# Altium project rovables_expansion.PrjPcb
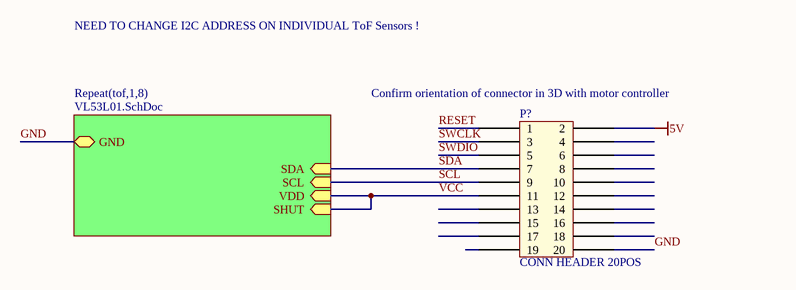
[diagram p0: expansion.SchDoc]
2 sheets, 41 parts. Net scope: hierarchical (ports join the sheet entries above them; power ports are global).
Board file: expansion.PcbDoc
Sheets:
  expansion.SchDoc
    tof1 = VL53L01.SchDoc
    tof2 = VL53L01.SchDoc
    tof3 = VL53L01.SchDoc
    tof4 = VL53L01.SchDoc
    tof5 = VL53L01.SchDoc
    tof6 = VL53L01.SchDoc
    tof7 = VL53L01.SchDoc
    tof8 = VL53L01.SchDoc

## Sheet expansion.SchDoc
size A; SheetNumber: 1; SheetTotal: 2

### Parts
P?  CONN HEADER 20POS  [DF12 20 POS]

### Sub-sheets
Repeat(tof,1,8) = VL53L01.SchDoc: GND (bidir), SCL (in), SDA (in), VDD (in), SHUT (in)

### Nets
5V: P?.2
GND: P?.20 ; sheet Repeat(tof,1,8)/GND
RESET: P?.1
SCL: P?.9 ; sheet Repeat(tof,1,8)/SCL
SDA: P?.7 ; sheet Repeat(tof,1,8)/SDA
SWCLK: P?.3
SWDIO: P?.5
VCC: P?.11 ; sheet Repeat(tof,1,8)/VDD, sheet Repeat(tof,1,8)/SHUT

Not connected (* = marked no-connect by the designer): P? 4 6 8 10 12 13 14 15 16 17 18 19

### Notes on the sheet
- NEED TO CHANGE I2C ADDRESS ON INDIVIDUAL ToF Sensors !
- (near P?) Confirm orientation of connector in 3D with motor controller

### Library data of the parts
P? = CONN HEADER 20POS: manufacturer part number: DF12D(4.0)-20DP-0.5V(81); manufacturer: Hirose Electric Co Ltd; digikey part number: H11743CT-ND; Supplier 1: Digi-Key; Supplier Part Number 1: H11743CT-ND

## Sheet VL53L01.SchDoc
size A; SheetNumber: 2; SheetTotal: 2
Used 8 times, as channels tof1, tof2, tof3, tof4, tof5, tof6, tof7, tof8. Parts and nets are listed once, with the designators drawn on the sheet.
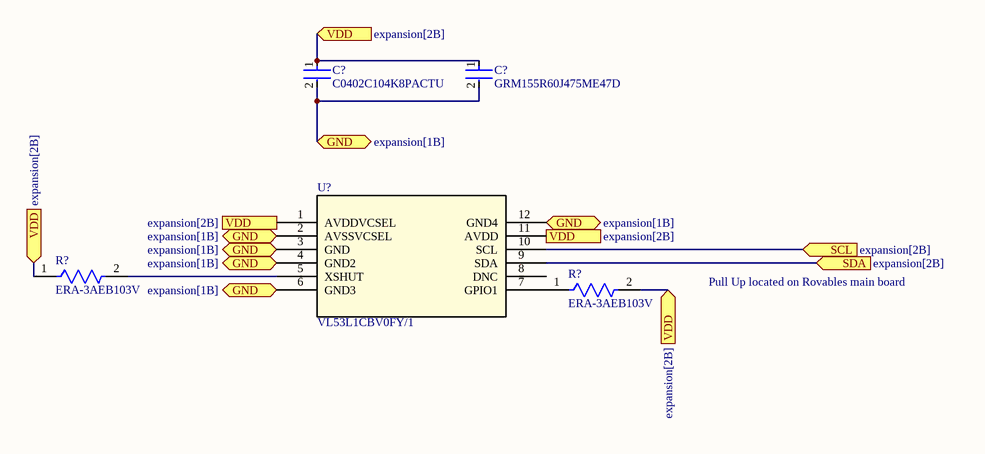
[diagram p1: VL53L01.SchDoc]

### Parts
(Parts that share a designator on the sheet are numbered #1, #2 ... from top to bottom, then left to right.)
C?#1  C0402C104K8PACTU  [FP-C0402-BB-MFG]
C?#2  GRM155R60J475ME47D  [FP-GRM155-0_1-IPC_B]
R?#1  ERA-3AEB103V  [FP-ERA3A-IPC_C]
R?#2  ERA-3AEB103V  [FP-ERA3A-IPC_C]
U?  VL53L1CBV0FY/1  [QFN_BV0FY/1_STM-M]

### Ports
GND (bidir, see expansion[1B]), SCL (in, see expansion[2B]), SDA (in, see expansion[2B]), VDD (in, see expansion[2B])

### Nets
GND: C?#1.2 C?#2.2 U?.2(AVSSVCSEL) U?.3(GND) U?.4(GND2) U?.6(GND3) U?.12(GND4) ; port GND
SCL: U?.10(SCL) ; port SCL
SDA: U?.9(SDA) ; port SDA
VDD: C?#1.1 C?#2.1 R?#1.1 R?#2.2 U?.1(AVDDVCSEL) U?.11(AVDD) ; port VDD
NetR?#1_2: R?#1.2 U?.5(XSHUT)
NetR?#2_1: R?#2.1 U?.7(GPIO1)

Not connected (* = marked no-connect by the designer): U? 8(DNC)

### Channels
tof1: designators C?=C?_tof1#1 C?=C?_tof1#2 R?=R?_tof1#1 R?=R?_tof1#2 U?=U?_tof1; ports GND=GND SCL=SCL SDA=SDA VDD=VCC
tof2: designators C?=C?_tof2#1 C?=C?_tof2#2 R?=R?_tof2#1 R?=R?_tof2#2 U?=U?_tof2; ports GND=GND SCL=SCL SDA=SDA VDD=VCC
tof3: designators C?=C?_tof3#1 C?=C?_tof3#2 R?=R?_tof3#1 R?=R?_tof3#2 U?=U?_tof3; ports GND=GND SCL=SCL SDA=SDA VDD=VCC
tof4: designators C?=C?_tof4#1 C?=C?_tof4#2 R?=R?_tof4#1 R?=R?_tof4#2 U?=U?_tof4; ports GND=GND SCL=SCL SDA=SDA VDD=VCC
tof5: designators C?=C?_tof5#1 C?=C?_tof5#2 R?=R?_tof5#1 R?=R?_tof5#2 U?=U?_tof5; ports GND=GND SCL=SCL SDA=SDA VDD=VCC
tof6: designators C?=C?_tof6#1 C?=C?_tof6#2 R?=R?_tof6#1 R?=R?_tof6#2 U?=U?_tof6; ports GND=GND SCL=SCL SDA=SDA VDD=VCC
tof7: designators C?=C?_tof7#1 C?=C?_tof7#2 R?=R?_tof7#1 R?=R?_tof7#2 U?=U?_tof7; ports GND=GND SCL=SCL SDA=SDA VDD=VCC
tof8: designators C?=C?_tof8#1 C?=C?_tof8#2 R?=R?_tof8#1 R?=R?_tof8#2 U?=U?_tof8; ports GND=GND SCL=SCL SDA=SDA VDD=VCC

### Notes on the sheet
- Pull Up located on Rovables main board

### Library data of the parts
C?#1 = CMP-2008-02046-2: CAP CER 0.1UF 10V X5R 0402; Manufacturer: Kemet; Material: Ceramic; Capacitance: 0.10 μF; Temperature Coefficient: 15%; Tolerance: 0.1; Value: 0.10 μF; Package: C0402-BB; Temperature: -55°C to +125°C; ComponentLink2Description: Datasheet; Temperature Characteristic: X5R; Device Class L1: Passive Components; Height: 0.55mm; Lead Free: Yes; ComponentLink2URL: https://content.kemet.com/datasheets/KEM_C1002_X7R_SMD.pdf; Device Class L2: Capacitors; Temperature Range Low: -55°C; Temperature Range High: +125°C; RoHS: TRUE; Octopart: https://octopart.com/c0402c104k8pactu-kemet-140039; Automotive: No; Mouser Description: Capacitor 100 nF 10 VDC 0402; Category: Cap; Voltage Rating: 10 V; Digikey Description: CAP CER 0.1UF 10V X5R 0402; Ipc Land Pattern Name: CAPC10050X50; Device Class L3: Ceramic Capacitors; Manufacturer Part Number: C0402C104K8PACTU
C?#2 = CMP-2008-04549-2: Chip Multilayer Ceramic Capacitors for General Purpose, 0402, 4.7uF, X5R, 15%, 20%, 6.3V; Height: 0.5mm; Weight: 0.000212oz; Length: 1mm; Case Code (Metric): 1005; Packaging: Tape and Reel; Termination: SMD/SMT; Dielectric: X5R; Depth: 0.5mm; Case Code (Imperial): 0402; Min Operating Temperature: -55°C; Case/Package: 0402; Voltage: 6.3V; Width: 0.02inch; Capacitance: 4.7uF; Lead Free: Lead Free; Thickness: 0.022inch; Contact Plating: Tin; REACH SVHC: No SVHC; Package Quantity: 10000; Tolerance: 20%; Voltage Rating (DC): 6.3V; Voltage Rating: 6.3V; Mount: Surface Mount; Max Operating Temperature: 85°C
R?#1 R?#2 = CMP-2000-00874-2: RES SMD 10K OHM 0.1% 1/10W 0603; Voltage Rating (DC): 75V; Power Rating: 100mW; Resistance: 10kR; Temperature Coefficient: 25ppm/°C; Radiation Hardening: No; Width: 0.8mm; Depth: 0.8mm; Construction: Rectangular; Case Code (Metric): 1608; Package Quantity: 5000; Length: 1.6mm; Size Code: 0603; Case Code (Imperial): 0603; Termination: SMD/SMT; Contact Plating: Tin; Resistance Tolerance: 0.1%; Military Standard: Not; Packaging: Tape and Reel; Max Power Dissipation: 100mW; REACH SVHC: No SVHC; Series: ERA-3A; Voltage Rating: 75V; Lead Free: Lead Free; Technology: METAL FILM; RoHS Compliant: Yes; Max Operating Temperature: 155°C; Resistor Type: Thin Film; Min Operating Temperature: -55°C; Number of Pins: 2; Case/Package: 0603; Tolerance: 0.1%; Height: 0.45mm; Mount: Surface Mount; Number of Terminations: 2
U? = VL53L1CBV0FY/1: No Description Available; Mfr_Name: STMicroelectronics; Copyright: Copyright (C) 2022 Ultra Librarian. All rights reserved.; Manufacturer_Part_Number: VL53L1CBV0FY/1; RefDes: RefDes; Type: DEV

## Nets that join several sheets
GND: expansion (P?.20), tof1 (7 pins), tof2 (7 pins), tof3 (7 pins), tof4 (7 pins), tof5 (7 pins), tof6 (7 pins), tof7 (7 pins), tof8 (7 pins)
SCL: expansion (P?.9), tof1 (U?_tof1.10), tof2 (U?_tof2.10), tof3 (U?_tof3.10), tof4 (U?_tof4.10), tof5 (U?_tof5.10), tof6 (U?_tof6.10), tof7 (U?_tof7.10), tof8 (U?_tof8.10)
SDA: expansion (P?.7), tof1 (U?_tof1.9), tof2 (U?_tof2.9), tof3 (U?_tof3.9), tof4 (U?_tof4.9), tof5 (U?_tof5.9), tof6 (U?_tof6.9), tof7 (U?_tof7.9), tof8 (U?_tof8.9)
VCC: expansion (P?.11), tof1 (6 pins), tof2 (6 pins), tof3 (6 pins), tof4 (6 pins), tof5 (6 pins), tof6 (6 pins), tof7 (6 pins), tof8 (6 pins)